# Altium project Highway_Final_Version.PrjPcb (part 2 of 2)

## Sheet 6v_BOOST.SchDoc
size Letter; Author: Lihong; Chenwei; SheetNumber: 7; SheetTotal: 8
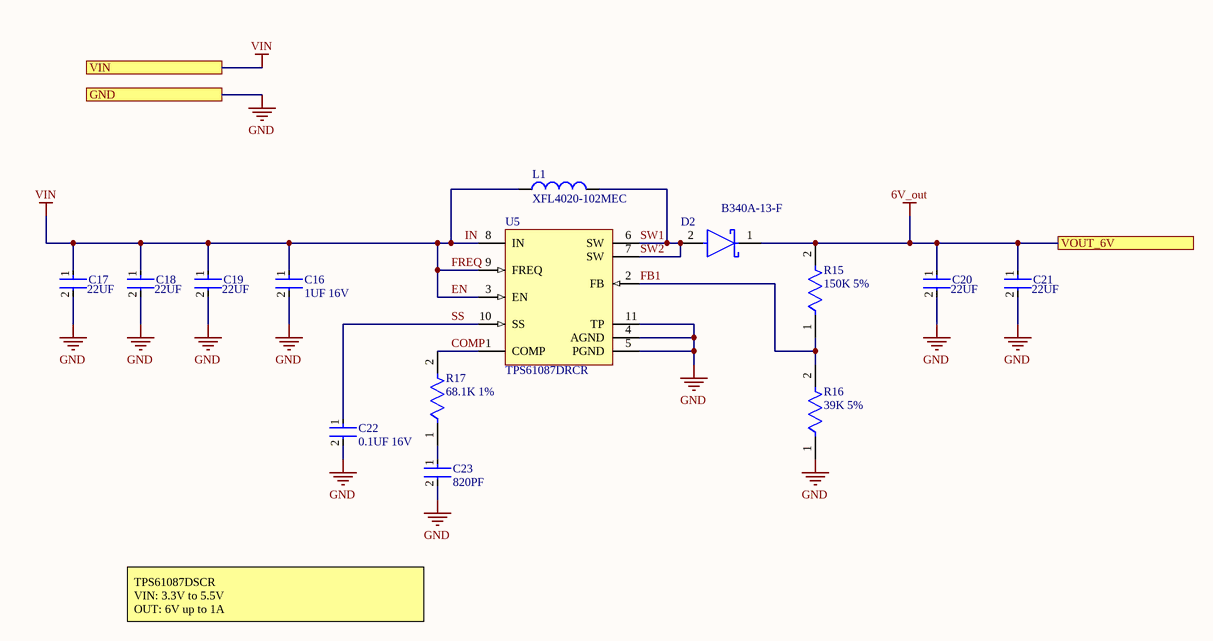
[diagram p5: 6v_BOOST.SchDoc]

### Parts
C16  1UF 16V  [FP-CC0603-DA-MFG]
C17  22UF  [FP-CC0805-0_2-1_45-IPC_C]
C18  22UF  [FP-CC0805-0_2-1_45-IPC_C]
C19  22UF  [FP-CC0805-0_2-1_45-IPC_C]
C20  22UF  [FP-CC0805-0_2-1_45-IPC_C]
C21  22UF  [FP-CC0805-0_2-1_45-IPC_C]
C22  0.1UF 16V  [FP-CC0402-MFG]
C23  820PF  [FP-CC0402-MFG]
D2  B340A-13-F  [FP-SMA-MFG]
L1  XFL4020-102MEC  [COIL-XFL4020_V]
R15  150K 5%  [FP-RMCF0603-IPC_A]
R16  39K 5%  [FP-RMCF0603-IPC_B]
R17  68.1K 1%  [FP-RMCF0402-IPC_C]
U5  TPS61087DRCR  [DRC0010J_V]

### Ports
GND, VIN, VOUT_6V

### Nets
6V_out: C20.1 C21.1 D2.1(C) R15.2 ; port VOUT_6V
EN: C16.1 C17.1 C18.1 C19.1 L1.1 U5.3(EN) U5.8(IN) U5.9(FREQ) ; port VIN  [also labelled FREQ, IN, VIN]  [project net VOUT]
GND: C16.2 C17.2 C18.2 C19.2 C20.2 C21.2 C22.2 C23.2 R16.1 U5.4(AGND) U5.5(PGND) U5.11(TP) ; port GND
COMP: R17.2 U5.1(COMP)
FB1: R15.1 R16.2 U5.2(FB)
SS: C22.1 U5.10(SS)
SW1: D2.2(A) L1.2 U5.6(SW) U5.7(SW)  [also labelled SW2]
NetC23_1: C23.1 R17.1

### Notes on the sheet
- TPS61087DSCR
  VIN: 3.3V to 5.5V
  OUT: 6V up to 1A
- Title:
- Desc:
- Size:
- Letter
- Auth:
- Proj:
- Sheet
- of
- www.seas.upenn.edu
- Electrical and Systems Engineering

### Library data of the parts
C16 = CMP-03422-001047-1: CC0603 1 uF X7R 10.00% 16 V; Manufacturer: YAGEO; Manufacturer Part Number: CC0603KPX7R7BB105; Temperature Coefficient: 15%; Tolerance: 0.1; Material: Ceramic; Device Class L3: Ceramic Capacitors; Temperature Characteristic: X7R; Device Class L2: Capacitors; Temperature Range Low: -55°C; Footprint Url: http://www.yageo.com/exep/pages/download/literatures/UPY-C_GEN_24.pdf; Device Class L1: Passive Components; Temperature: -55°C to +125°C; Voltage Rating: 16 V; RoHS: TRUE; ComponentLink2URL: http://www.yageo.com/documents/recent/UPY-GPHC_X7R_6.3V-to-50V_18.pdf; Mouser Description: Cap Ceramic 1uF 16V X7R 10% SMD 0603 125°C Paper T/R; Octopart: https://octopart.com/cc0603kpx7r7bb105-yageo-25629533; Automotive: No; Capacitance: 1 uF; Height: 0.9mm; Voltage: 16 V; Lead Free: Yes; Category: Cap; Package: CC0603-DA; Temperature Range High: +125°C; Value: 1 uF; ComponentLink2Description: Datasheet
C17-C21 = CMP-03422-001497-1: CAP CER 22UF 25V X5R 0805; Tolerance: 20%; Max Operating Temperature: 85°C; Dielectric: X5R; Termination: SMD/SMT; Voltage Rating: 25V; Width: 0.049inch; Min Operating Temperature: -55°C; Case/Package: 0805; Lead Free: Lead Free; RoHS Compliant: Yes; Weight: 0.000194oz; Voltage Rating (DC): 25V; Capacitance: 22uF; Length: 0.079inch; Halogen Free: Halogen Free; Height: 1.25mm; Packaging: Tape and Reel; Package Quantity: 3000; Case Code (Metric): 2012; Thickness: 0.057inch; Case Code (Imperial): 0805; Mount: Surface Mount
C22 = CMP-03422-000946-1: CC0402 100 nF X7R 10.00% 25 V; Manufacturer Part Number: CC0402KPX7R8BB104; Manufacturer: YAGEO; Capacitance: 100 nF; Material: Ceramic; Tolerance: 0.1; Value: 100 nF; Temperature Coefficient: 30ppm/°C; Automotive Grade: NA; Voltage Rating: 25 V; Footprint Url: http://www.yageo.com/exep/pages/download/literatures/UPY-C_GEN_24.pdf; ComponentLink2Description: Datasheet; Device Class L2: Capacitors; Device Class L3: Ceramic Capacitors; Height: 0.55mm; Ipc Land Pattern Name: CAPC10050X50; Category: Cap; ComponentLink2URL: http://www.yageo.com/documents/recent/UPY-GP_NP0_16V-to-50V_16.pdf; Automotive: No; Temperature: -55°C to +125°C; Lead Free: Yes; Temperature Range High: +125°C; Temperature Range Low: -55°C; Temperature Characteristic: X7R; Package: CC0402; RoHS: TRUE; Octopart: https://octopart.com/cc0402kpx7r8bb104-yageo-61757486; Device Class L1: Passive Components
C23 = CMP-2002-03061-2: CAP CER 820PF 50V X7R 0402; Manufacturer Part Number: CC0402KRX7R9BB821; Manufacturer: YAGEO; Material: Ceramic; Temperature Coefficient: 30ppm/°C; Tolerance: 0.1; Automotive Grade: NA; RoHS: TRUE; Device Class L1: Passive Components; Temperature: -55°C to +125°C; Capacitance: 820 pF; Footprint Url: http://www.yageo.com/exep/pages/download/literatures/UPY-C_GEN_24.pdf; Automotive: No; Height: 0.55mm; Lead Free: Yes; Temperature Characteristic: X7R; Device Class L3: Ceramic Capacitors; Voltage Rating: 50 V; Ipc Land Pattern Name: CAPC10050X50; Mouser Description: 0402 820 pF 50 V ±10 % Tolerance X7R SMT Multilayer Ceramic Capacitor; Package: CC0402; Temperature Range Low: -55°C; ComponentLink2URL: http://www.yageo.com/documents/recent/UPY-GP_NP0_16V-to-50V_16.pdf; Digikey Description: CAP CER 820PF 50V X7R 0402; Temperature Range High: +125°C; Category: Cap; ComponentLink2Description: Datasheet; Value: 820 pF; Device Class L2: Capacitors; Octopart: https://octopart.com/cc0402krx7r9bb821-yageo-9291732
D2 = CMP-1667-00003-3: DIODE SCHOTTKY 40V 3A SMA; Forward Voltage: 500mV; Max Forward Surge Current (Ifsm): 80A; Polarity: Standard; Max Reverse Current: 500uA; Capacitance: 250pF; Element Configuration: Single; Min Operating Temperature: -55°C; Mount: Surface Mount; Max Operating Temperature: 125°C; Radiation Hardening: No; Length: 4.6mm; Height: 2.3mm; Forward Current: 3A; Packaging: Tape and Reel; Package Quantity: 5000; REACH SVHC: No SVHC; Width: 2.92mm; Output Current: 3A; Current Rating: 3A; Termination: SMD/SMT; Voltage: 40V; Series: -; Current: 3A; Max Repetitive Reverse Voltage (Vrrm): 40V; Number of Pins: 2; Average Rectified Current: 3A; Contact Plating: Tin; RoHS Compliant: Yes; Max Reverse Voltage (DC): 40V; Case/Package: SMA; Weight: 0.002258oz; Peak Non-Repetitive Surge Current: 80A; Lead Free: Lead Free; Voltage Rating (DC): 40V
L1 = CMP-2000-07423-1: Shielded Power Inductor, 1 uH, 64 MHz, -40 to 125 degC, 2-Pin SMD, RoHS, Tape and Reel; Manufacturer: Coilcraft; Case Width: 4.3mm; Case Height: 2.1mm; Maximum DC Current: 11A; Core Material: Composite; Test Frequency: 100kHz; Tolerance: 20%; Maximum DC Resistance: 11.9mOhms; Inductance: 1uH; Self Resonant Frequency: 64MHz; RoHS: Details; Series: XFL4020; Case Length: 4.3mm; Package Reference: XFL4020; Dimensions: 4.3mmWx4.3mmLx2.1mmH; Product: PowerInductors; Datasheet Version: 07/2012; Manufacturer URL: http://www.coilcraft.com/; Termination Style: SMD/SMT; Mounting Technology: SurfaceMount; Operating Temperature Range: -40Cto+125C; Package Description: 2-Pin Surface Mount Device, Body 4 x 4 mm, Pitch 2.37 mm; Shielding: Shielded; Packaging: Reel; Datasheet URL: http://www.mouser.com/ds/2/597/xfl4020-270756.pdf
R15 = CMP-26527-004955-1: 150kΩ ±5% 0.1W 0603 Thick Film Chip Resistor AEC-Q200 compliant; Max Power Dissipation: 100mW; Temperature Coefficient: 200ppm/°C; Resistance: 150kR; Features: Automotive AEC-Q200; Width: 0.031inch; Max Operating Temperature: 155°C; Size Code: 0603; Mount: Surface Mount; Resistor Type: Thick Film; Number of Terminations: 2; Height: 0.022inch; Construction: Rectangular; Radiation Hardening: No; Series: RMCF; Case/Package: 0603; Length: 0.061inch; Case Code (Metric): 1608; Military Standard: Not; Tolerance: 5%; Packaging: Tape and Reel; Depth: 0.8mm; Power Rating: 100mW; Contact Plating: Tin; Case Code (Imperial): 0603; Min Operating Temperature: -55°C; RoHS Compliant: Yes; Lead Free: Lead Free
R16 = CMP-26527-002854-1: 39kΩ ±5% 0.1W 0603 Thick Film Chip Resistor AEC-Q200 compliant; Working Voltage: 75V; Power Rating: 100mW; Resistance: 39kR; Temperature Coefficient: 200ppm/°C; Case/Package: 0603; Packaging: Tape and Reel; Case Code (Metric): 1608; Technology: THICK FILM; Series: RMCF; Min Operating Temperature: -55°C; Radiation Hardening: No; Mount: Surface Mount; Height: 0.022inch; Width: 0.031inch; Contact Plating: Tin; Package Quantity: 5000; Max Power Dissipation: 100mW; RoHS Compliant: Yes; Length: 0.061inch; Number of Terminations: 2; Max Operating Temperature: 155°C; Features: Automotive AEC-Q200; Lead Free: Lead Free; Tolerance: 5%; Case Code (Imperial): 0603; Resistor Type: Thick Film
R17 = CMP-26527-007353-1: 68.1kΩ ±1% 0.063W 0402 Thick Film Chip Resistor AEC-Q200 compliant; Power Rating: 63mW; Resistance: 68.1kR; Temperature Coefficient: 100ppm/°C; Lead Free: Lead Free; Size Code: 0402; Case/Package: 0402; RoHS Compliant: Yes; Mount: Surface Mount; Height: 0.016inch; Number of Terminations: 2; Case Code (Imperial): 0402; Max Operating Temperature: 155°C; Radiation Hardening: No; Contact Plating: Tin; Resistor Type: Thick Film; Features: Automotive AEC-Q200; Package Quantity: 10000; Max Power Dissipation: 63mW; Width: 0.02inch; Min Operating Temperature: -55°C; Series: RMCF; Case Code (Metric): 1005; Length: 0.039inch; Packaging: Tape and Reel; Tolerance: 1%
U5 = CMP-0343-00035-2: Boost Voltage Converter with 2.5 to 6 V Input and 3 to 18.5 V Output, -40 to 85 degC, 10-Pin SON (DRC), Green (RoHS & no Sb/Br); Manufacturer: Texas Instruments; Vout(Max)(V): 18.5; Switching Frequency(Typ)(kHz): 650, 1200; SubFamily: Step-Up Regulator; Regulated Outputs(#): 1; Vout(Min)(V): 3; Vin(Min)(V): 2.5; Vin(Max)(V): 6; PartNumber: TPS61087DRCR; ComponentLink1Description: Datasheet; Mounting Technology: Surface Mount; Eco-Plan: Green (RoHS & no Sb/Br); Topology: Boost; PackageVersion: revL, Sep-2011; DatasheetVersion: SLVS821B; ComponentLink1URL: http://www.ti.com/general/docs/lit/getliterature.tsp?genericPartNumber=TPS61087&fileType=pdf; ComponentLink2URL: http://www.ti.com/litv/pdf/mpds117k; ComponentLink2Description: Package Specification; PackageDescription: 10-Pin Plastic Small Outline No-Lead, 3 x 3 x 1 mm Body, 0.5 mm Pitch, Exposed Pad; PackageReference: DRC0010J

## Sheet 3.3v_BUCK.SchDoc
size Letter; Author: Lihong; Chenwei; SheetNumber: 4; SheetTotal: 8
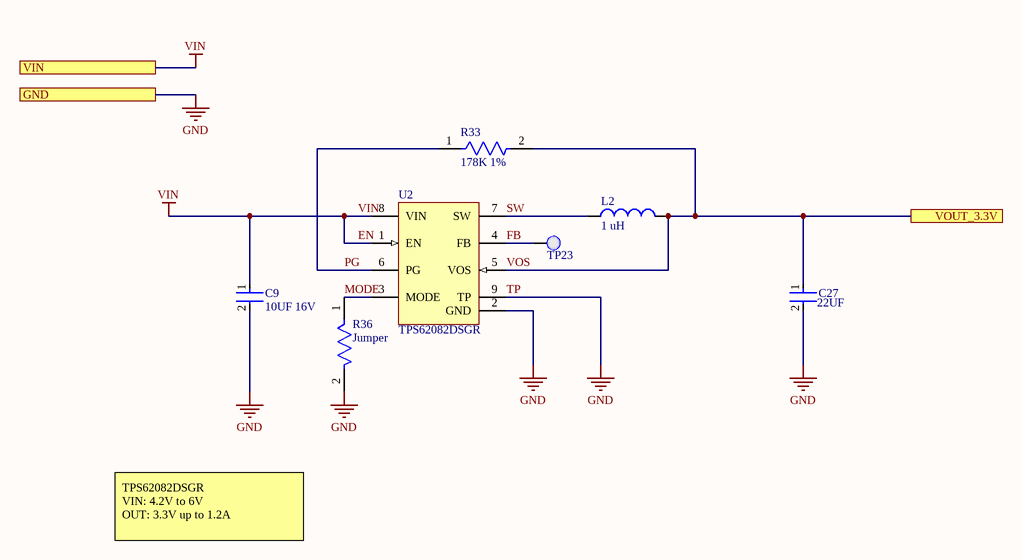
[diagram p6: 3.3v_BUCK.SchDoc]

### Parts
C9  10UF 16V  [FP-CC0603-DB-MFG]
C27  22UF  [FP-CC0805-0_2-1_45-IPC_C]
L2  1 uH  [COIL-XFL4020_V]
R33  178K 1%  [FP-RMCF1210-IPC_B]
R36  Jumper  [FP-RMCF0603-MFG]
TP23  Test Point 0.1"  [Test Point 0.1"-Footprint-1]  (value not drawn)  (no BOM)
U2  TPS62082DSGR  [DSG0008A_V]

### Ports
GND, VIN, VOUT_3.3V

### Nets
EN: C9.1 U2.1(EN) U2.8(VIN) ; port VIN  [also labelled VIN]  [project net VOUT]
GND: C9.2 C27.2 R36.2 U2.2(GND) U2.9(TP) ; port GND  [also labelled TP]
FB: TP23.1(PAD) U2.4(FB)
MODE: R36.1 U2.3(MODE)
PG: R33.1 U2.6(PG)
SW: L2.1 U2.7(SW)
VOS: C27.1 L2.2 R33.2 U2.5(VOS) ; port VOUT_3.3V

### Notes on the sheet
- TPS62082DSGR
  VIN: 4.2V to 6V
  OUT: 3.3V up to 1.2A
- Title:
- Desc:
- Size:
- Letter
- Auth:
- Proj:
- Sheet
- of
- www.seas.upenn.edu
- Electrical and Systems Engineering

### Library data of the parts
C9 = CMP-1035-02797-2: CAP CER 10UF 6.3V X5R 0603; Dissipation Factor: 10%; Tolerance: 20%; Depth: 0.8mm; Dielectric: X5R; Height: 0.8mm; Min Operating Temperature: -55°C; Package Quantity: 4000; Radiation Hardening: No; Mount: Surface Mount; Termination: SMD/SMT; Case/Package: 0603; Max Operating Temperature: 85°C; Case Code (Imperial): 0603; RoHS Compliant: Yes; Number of Pins: 2; Lead Free: Lead Free; Resistor Type: Ceramic; Thickness: 0.039inch; Construction: Flat; Width: 0.031inch; Length: 1.6mm; Capacitance: 10uF; Voltage Rating: 6.3V; Series: CC; REACH SVHC: No SVHC; Packaging: Tape and Reel; Case Code (Metric): 1608; Voltage Rating (DC): 6.3V; Halogen Free: Halogen Free
C27 = CMP-03422-001497-1: as C17 on sheet 6v_BOOST; Max Operating Temperature: 85°C; Dielectric: X5R; Termination: SMD/SMT; Voltage Rating: 25V; Width: 0.049inch; Min Operating Temperature: -55°C; Case/Package: 0805; Lead Free: Lead Free; RoHS Compliant: Yes; Weight: 0.000194oz; Voltage Rating (DC): 25V; Capacitance: 22uF; Length: 0.079inch; Halogen Free: Halogen Free; Height: 1.25mm; Packaging: Tape and Reel; Package Quantity: 3000; Case Code (Metric): 2012; Thickness: 0.057inch; Case Code (Imperial): 0805; Mount: Surface Mount
L2 = CMP-2000-07423-1: as L1 on sheet 6v_BOOST; RoHS: Details; Series: XFL4020; Case Length: 4.3mm; Package Reference: XFL4020; Dimensions: 4.3mmWx4.3mmLx2.1mmH; Product: PowerInductors; Datasheet Version: 07/2012; Manufacturer URL: http://www.coilcraft.com/; Termination Style: SMD/SMT; Mounting Technology: SurfaceMount; Operating Temperature Range: -40Cto+125C; Package Description: 2-Pin Surface Mount Device, Body 4 x 4 mm, Pitch 2.37 mm; Shielding: Shielded; Packaging: Reel; Datasheet URL: http://www.mouser.com/ds/2/597/xfl4020-270756.pdf
R33 = CMP-26527-007303-1: 178kΩ ±1% 0.5W 1210 Thick Film Chip Resistor AEC-Q200 compliant; Temperature Coefficient: 100ppm/°C; Max Power Dissipation: 333mW; Resistance: 178kR; Series: RMCF; Case/Package: 1210; Package Quantity: 4000; Number of Terminations: 2; Case Code (Metric): 3225; Case Code (Imperial): 1210; Tolerance: 1%; Max Operating Temperature: 155°C; Length: 0.126inch; Packaging: Tape and Reel; Width: 0.098inch; Features: Automotive AEC-Q200; Radiation Hardening: No; RoHS Compliant: Yes; Resistor Type: Thick Film; Mount: Surface Mount; Contact Plating: Tin; Min Operating Temperature: -55°C; Height: 0.028inch
R36 = CMP-26527-000011-1: RES 0 OHM JUMPER 1/10W 0603; Manufacturer Part Number: RMCF0603ZT0R00; Manufacturer: Stackpole; Power Rating: 0.1W; Voltage Rating: 75V; Resistance: 0mΩ; Automotive Grade: Grade 0; Value: 0mΩ; Series: RMCF; Device Class L1: Passive Components; Device Class L3: Chip SMD Resistors; Octopart: https://octopart.com/rmcf0603zt0r00-stackpole+electronics-19213618; Temperature: -55°C to +155°C; Lead Free: Yes; ComponentLink2URL: https://www.seielect.com/catalog/sei-rmcf_rmcp.pdf; Height: 0.55mm; Composition: Thick Film; Package: RMCF0603; Automotive: Yes; Temperature Range High: +155°C; Ipc Land Pattern Name: RESC15580X45; Digikey Description: RES 0 OHM JUMPER 1/10W 0603; RoHS: TRUE; ComponentLink2Description: Datasheet; Temperature Range Low: -55°C; Category: Res; Device Class L2: Resistors
TP23 = CMP-00086-1
U2 = CMP-0323-00344-3: Buck Step Down Regulator with 2.3 to 6 V Input and 3.3 V Output, -40 to 85 degC, 8-Pin WSON (DSG), Green (RoHS & no Sb/Br); Manufacturer: Texas Instruments; Switch Current Limit(Typ)(A): 2.4; Vin(Min)(V): 2.3; Iq(Typ)(mA): 0.006; Regulated Outputs(#): 1; Vout(Max)(V): 3.3; Duty Cycle(Max)(%): 100; Iout(Max)(A): 1.2; SubFamily: Step-Down Regulator; Rating: Catalog; Vin(Max)(V): 6; ComponentLink1Description: Datasheet; ComponentLink3Description: URL Link1; ComponentLink2URL: http://www.ti.com/litv/pdf/mpds308a; DatasheetVersion: SLVSAE8B; PackageVersion: revB, Oct-2010; Eco-Plan: Green (RoHS & no Sb/Br); ComponentLink2Description: Package Specification; PackageReference: DSG0008A; Code_JEDEC: MO-229; Topology: Buck; PartNumber: TPS62082DSGR; PackageDescription: 8-Pin Plastic Small Outline No-Lead, 2 x 2 x 0.8 mm Body, 0.5 mm Pitch, Exposed Pad; ComponentLink1URL: http://www.ti.com/general/docs/lit/getliterature.tsp?genericPartNumber=TPS62082&fileType=pdf; ComponentLink3URL: Samples URL:http://www.ti.com/product/tps62082#samples; Vout(Min)(V): 3.3; Mounting Technology: Surface Mount

## Sheet LoadCell_Driver.SchDoc
size Letter; Author: Lihong; Chenwei; SheetNumber: 8; SheetTotal: 8
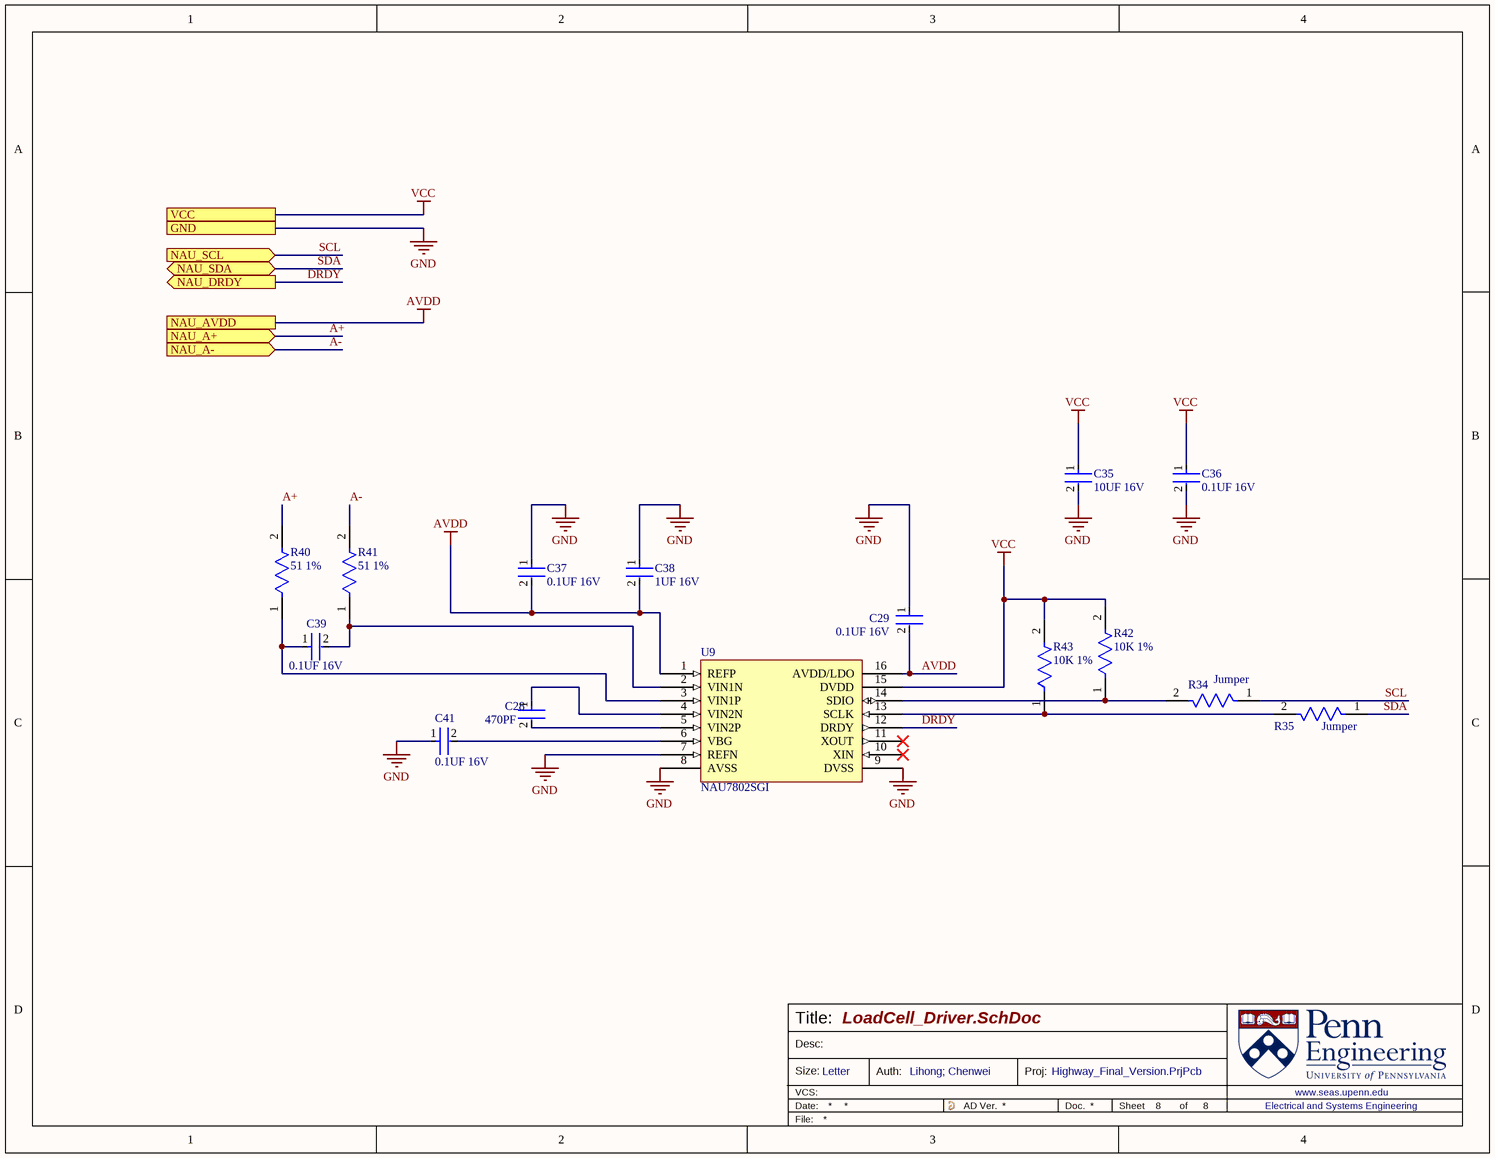
[diagram p7: LoadCell_Driver.SchDoc]

### Parts
C28  470PF  [FP-0402-L_1_0_1-W_0_5_0_1-IPC_A]
C29  0.1UF 16V  [FP-CC0402-MFG]
C35  10UF 16V  [FP-CC0603-DB-MFG]
C36  0.1UF 16V  [FP-CC0402-MFG]
C37  0.1UF 16V  [FP-CC0402-MFG]
C38  1UF 16V  [FP-CC0603-DA-MFG]
C39  0.1UF 16V  [FP-CC0402-MFG]
C41  0.1UF 16V  [FP-CC0402-MFG]
R34  Jumper  [FP-RMCF0603-MFG]
R35  Jumper  [FP-RMCF0603-MFG]
R40  51 1%  [FP-RMCF0402-IPC_C]
R41  51 1%  [FP-RMCF0402-IPC_C]
R42  10K 1%  [FP-RNCP0603-IPC_A]
R43  10K 1%  [FP-RNCP0603-IPC_A]
U9  NAU7802SGI  [SOP127P600X175-16N]

### Ports
GND, NAU_A+ (in), NAU_A- (in), NAU_AVDD, NAU_DRDY (out), NAU_SCL (in), NAU_SDA (bidir), VCC

### Nets
AVDD: C29.2 C37.2 C38.2 U9.1(REFP) U9.16(AVDD/LDO) ; port NAU_AVDD
GND: C29.1 C35.2 C36.2 C37.1 C38.1 C41.1 U9.7(REFN) U9.8(AVSS) U9.9(DVSS) ; port GND
VCC: C35.1 C36.1 R42.2 R43.2 U9.15(DVDD) ; port VCC  [project net 3V3]
A+: R40.2 ; port NAU_A+  [project net NAU_A+]
A-: R41.2 ; port NAU_A-  [project net NAU_A-]
DRDY: U9.12(DRDY) ; port NAU_DRDY  [project net NAU_DRDY]
SCL: R34.1 ; port NAU_SCL  [project net NAU_SCL]
SDA: R35.1 ; port NAU_SDA  [project net NAU_SDA]
NetC28_1: C28.1 U9.4(VIN2N)
NetC28_2: C28.2 U9.5(VIN2P)
NetC39_1: C39.1 R40.1 U9.3(VIN1P)
NetC39_2: C39.2 R41.1 U9.2(VIN1N)
NetC41_2: C41.2 U9.6(VBG)
NetR34_2: R34.2 R42.1 U9.14(SDIO)
NetR35_2: R35.2 R43.1 U9.13(SCLK)

Not connected (* = marked no-connect by the designer): U9 10(XIN)* 11(XOUT)*

### Notes on the sheet
- Title:
- Desc:
- Size:
- Letter
- Auth:
- Proj:
- Sheet
- of
- www.seas.upenn.edu
- Electrical and Systems Engineering

### Library data of the parts
C28 = CMP-1034-01502-3: General Purpose Ceramic Capacitor, 0402, 470pF, 10%, X7R, 15%, 50V; Series: -; Height: 0.5mm; Termination: SMD/SMT; Packaging: Tape and Reel; Tolerance: 10%; REACH SVHC: No SVHC; Package Quantity: 10000; Case Code (Imperial): 0402; Voltage: 50V; Depth: 0.5mm; Case Code (Metric): 1005; Voltage Rating: 50V; Radiation Hardening: No; Construction: Flat; Mount: Surface Mount; Dielectric: X7R; Min Operating Temperature: -55°C; Width: 0.5mm; Number of Pins: 2; Case/Package: 0402; RoHS Compliant: Yes; Thickness: 0.022inch; Lead Free: Lead Free; Voltage Rating (DC): 50V; Max Operating Temperature: 125°C; Capacitance: 470pF; Length: 1mm; Contact Plating: Tin
C29 C36 C37 C39 C41 = CMP-03422-000946-1: as C22 on sheet 6v_BOOST; Footprint Url: http://www.yageo.com/exep/pages/download/literatures/UPY-C_GEN_24.pdf; ComponentLink2Description: Datasheet; Device Class L2: Capacitors; Device Class L3: Ceramic Capacitors; Height: 0.55mm; Ipc Land Pattern Name: CAPC10050X50; Category: Cap; ComponentLink2URL: http://www.yageo.com/documents/recent/UPY-GP_NP0_16V-to-50V_16.pdf; Automotive: No; Temperature: -55°C to +125°C; Lead Free: Yes; Temperature Range High: +125°C; Temperature Range Low: -55°C; Temperature Characteristic: X7R; Package: CC0402; RoHS: TRUE; Octopart: https://octopart.com/cc0402kpx7r8bb104-yageo-61757486; Device Class L1: Passive Components
C35 = CMP-1035-02797-2: as C9 on sheet 3.3v_BUCK; Depth: 0.8mm; Dielectric: X5R; Height: 0.8mm; Min Operating Temperature: -55°C; Package Quantity: 4000; Radiation Hardening: No; Mount: Surface Mount; Termination: SMD/SMT; Case/Package: 0603; Max Operating Temperature: 85°C; Case Code (Imperial): 0603; RoHS Compliant: Yes; Number of Pins: 2; Lead Free: Lead Free; Resistor Type: Ceramic; Thickness: 0.039inch; Construction: Flat; Width: 0.031inch; Length: 1.6mm; Capacitance: 10uF; Voltage Rating: 6.3V; Series: CC; REACH SVHC: No SVHC; Packaging: Tape and Reel; Case Code (Metric): 1608; Voltage Rating (DC): 6.3V; Halogen Free: Halogen Free
C38 = CMP-03422-001047-1: as C16 on sheet 6v_BOOST; Device Class L3: Ceramic Capacitors; Temperature Characteristic: X7R; Device Class L2: Capacitors; Temperature Range Low: -55°C; Footprint Url: http://www.yageo.com/exep/pages/download/literatures/UPY-C_GEN_24.pdf; Device Class L1: Passive Components; Temperature: -55°C to +125°C; Voltage Rating: 16 V; RoHS: TRUE; ComponentLink2URL: http://www.yageo.com/documents/recent/UPY-GPHC_X7R_6.3V-to-50V_18.pdf; Mouser Description: Cap Ceramic 1uF 16V X7R 10% SMD 0603 125°C Paper T/R; Octopart: https://octopart.com/cc0603kpx7r7bb105-yageo-25629533; Automotive: No; Capacitance: 1 uF; Height: 0.9mm; Voltage: 16 V; Lead Free: Yes; Category: Cap; Package: CC0603-DA; Temperature Range High: +125°C; Value: 1 uF; ComponentLink2Description: Datasheet
R34 R35 = CMP-26527-000011-1: as R36 on sheet 3.3v_BUCK; Series: RMCF; Device Class L1: Passive Components; Device Class L3: Chip SMD Resistors; Octopart: https://octopart.com/rmcf0603zt0r00-stackpole+electronics-19213618; Temperature: -55°C to +155°C; Lead Free: Yes; ComponentLink2URL: https://www.seielect.com/catalog/sei-rmcf_rmcp.pdf; Height: 0.55mm; Composition: Thick Film; Package: RMCF0603; Automotive: Yes; Temperature Range High: +155°C; Ipc Land Pattern Name: RESC15580X45; Digikey Description: RES 0 OHM JUMPER 1/10W 0603; RoHS: TRUE; ComponentLink2Description: Datasheet; Temperature Range Low: -55°C; Category: Res; Device Class L2: Resistors
R40 R41 = CMP-26527-001784-1: 51Ω ±1% 0.063W 0402 Thick Film Chip Resistor AEC-Q200 compliant; Resistance: 51R; Temperature Coefficient: 100ppm/°C; Max Power Dissipation: 63mW; RoHS Compliant: Yes; Series: RMCF; Packaging: Cut Tape; Contact Plating: Tin; Length: 0.039inch; Resistor Type: Thick Film; Mount: Surface Mount; Max Operating Temperature: 155°C; Lead Free: Contains Lead; Case/Package: 0402; Case Code (Metric): 1005; Min Operating Temperature: -55°C; Width: 0.02inch; Case Code (Imperial): 0402; Package Quantity: 1; Tolerance: 1%; Number of Terminations: 2; Features: Automotive AEC-Q200; Height: 0.016inch
R42 R43 = CMP-26527-000099-1: 10kΩ ±1% 0.125W 0603 High Power Anti-Sulfur Thin Film Chip Resistor; Resistance: 10kR; Max Power Dissipation: 125mW; Temperature Coefficient: 100ppm/°C; Max Operating Temperature: 155°C; Width: 0.031inch; Height: 0.02inch; Lead Free: Lead Free; Contact Plating: Tin; Tolerance: 1%; Resistor Type: Thin Film; Series: RNCP; RoHS Compliant: Yes; Features: Moisture Resistant; Min Operating Temperature: -55°C; Case Code (Metric): 1608; Case/Package: 0603; Mount: Surface Mount; Packaging: Tape and Reel; Radiation Hardening: No; Length: 0.059inch; Number of Terminations: 2; Case Code (Imperial): 0603
U9 = CMP-00103-2: ADC, Delta-Sigma, 24-Bit, 1 Func, 2 Channel, Serial Access, PDSO16

## Nets that join several sheets
3V3: MAIN (6 pins), MCU (7 pins), Memory (5 pins), LoadCell_Driver (5 pins)
6V_out: MAIN (R22.1), 6v_BOOST (C20.1 C21.1 D2.1 R15.2)
AVDD: MAIN (J2.1), LoadCell_Driver (5 pins)
GND: MAIN (17 pins), FTDI (10 pins), MCU (19 pins), Memory (5 pins), LiPo_Charger (11 pins), 6v_BOOST (12 pins), 3.3v_BUCK (5 pins), LoadCell_Driver (9 pins)
VBAT: MAIN (P1.2), LiPo_Charger (C26.1 U6.2 U6.3)
VBUS: MAIN (J1.1), FTDI (C2.1 D1.4 FB1.1)
VOUT: MAIN (R23.2), 6v_BOOST (8 pins), 3.3v_BUCK (C9.1 U2.1 U2.8)
Vout_BQ: MAIN (R23.1), LiPo_Charger (6 pins)
VUSB: MAIN (TP1.1), FTDI (6 pins), LiPo_Charger (C24.1 U6.13)
BQ_BAT_TS: MAIN (R6.2 TP5.1), LiPo_Charger (U6.1)
FLASH_MEM_SPI_SS: MCU (U4.37), Memory (R13.1 SD1.2 TP11.1)
MCU_LED: MAIN (D8.K), MCU (U4.16)
MCU_RX_UART_CLI: MAIN (TP4.1), FTDI (U1.7), MCU (U4.44)
MCU_Test_Button: MAIN (C8.1 R25.1 R28.2), MCU (U4.41)
MCU_TX_UART_CLI: MAIN (TP2.1), FTDI (U1.10), MCU (U4.43)
MEM_SPI_CLK: MAIN (R10.2), Memory (SD1.5 TP10.1)
MEM_SPI_MISO: MAIN (R9.2), Memory (SD1.7 TP9.1)
MEM_SPI_MOSI: MAIN (R8.2), Memory (SD1.3 TP8.1)
NAU_A+: MAIN (J2.2), LoadCell_Driver (R40.2)
NAU_A-: MAIN (J2.3), LoadCell_Driver (R41.2)
NAU_DRDY: MCU (TP18.1 U4.27), LoadCell_Driver (U9.12)
NAU_SCL: MCU (TP17.1 U4.9), LoadCell_Driver (R34.1)
NAU_SDA: MCU (TP19.1 U4.15), LoadCell_Driver (R35.1)
OLED_SCL: MAIN (R31.2 R32.1), MCU (TP21.1 U4.39)
OLED_SDA: MAIN (R26.2 R27.1), MCU (TP20.1 U4.38)
PA03: MAIN (R29.1), MCU (U4.33)
PA05: MAIN (J4.1), MCU (U4.35)
PA06: MAIN (J4.2), MCU (U4.36)
PA20: MAIN (J4.3), MCU (U4.13)
PA21: MAIN (J4.4), MCU (U4.14)
PB03: MAIN (J4.5), MCU (U4.28)
PWM: MAIN (J3.2), MCU (TP22.1 U4.40)
SERCOM1_PAD2_SPI_MISO: MAIN (R9.1), MCU (U4.8)
SERCOM1_PAD2_SPI_MOSI: MAIN (R8.1), MCU (U4.11)
SERCOM1_PAD3_SPI_SCK: MAIN (R10.1), MCU (U4.12)
USB_DATA_N: MAIN (J1.2), FTDI (C5.2 D1.3 R1.1)
USB_DATA_P: MAIN (J1.3), FTDI (C6.2 D1.2 R2.1)
VOS: MAIN (R24.1), 3.3v_BUCK (C27.1 L2.2 R33.2 U2.5)

## Assembly variants
Build_Alt: not fitted FD1 FD2 FD3 J2 J3 J4 J5 P1 TP1 TP2 TP3 TP4 TP5 TP6 TP7 TP8 TP9 TP10 TP11 TP12 TP13 TP14 TP15 TP16 TP17 TP18 TP19 TP20 TP21 TP22 TP23 U3 U?